# Altium schematic sheet MicroSD.SchDoc: Cartão SD
size A4; ENG_APP_DATE: --/--/--; DSN_APP_DATE: --/--/--; CHK_APP_DATE: --/--/--; Date: *******; ApprovedBy: *******; CheckedBy: None; Author: *******; CompanyName: *******; DrawnBy: Name; Engineer: *******; Organization: *******; Address1: *******; Address2: *******; Address3: *******; Address4: *******; DocumentNumber: Doc Num; Revision: *******; SheetNumber: 6; SheetTotal: 7; CurrentTime: *******; CurrentDate: *******; Time: *******; DocumentFullPathAndName: *******; DocumentName: *******; ModifiedDate: *******; ImagePath: *******; ProjectName: *******; Application_BuildNumber: *******
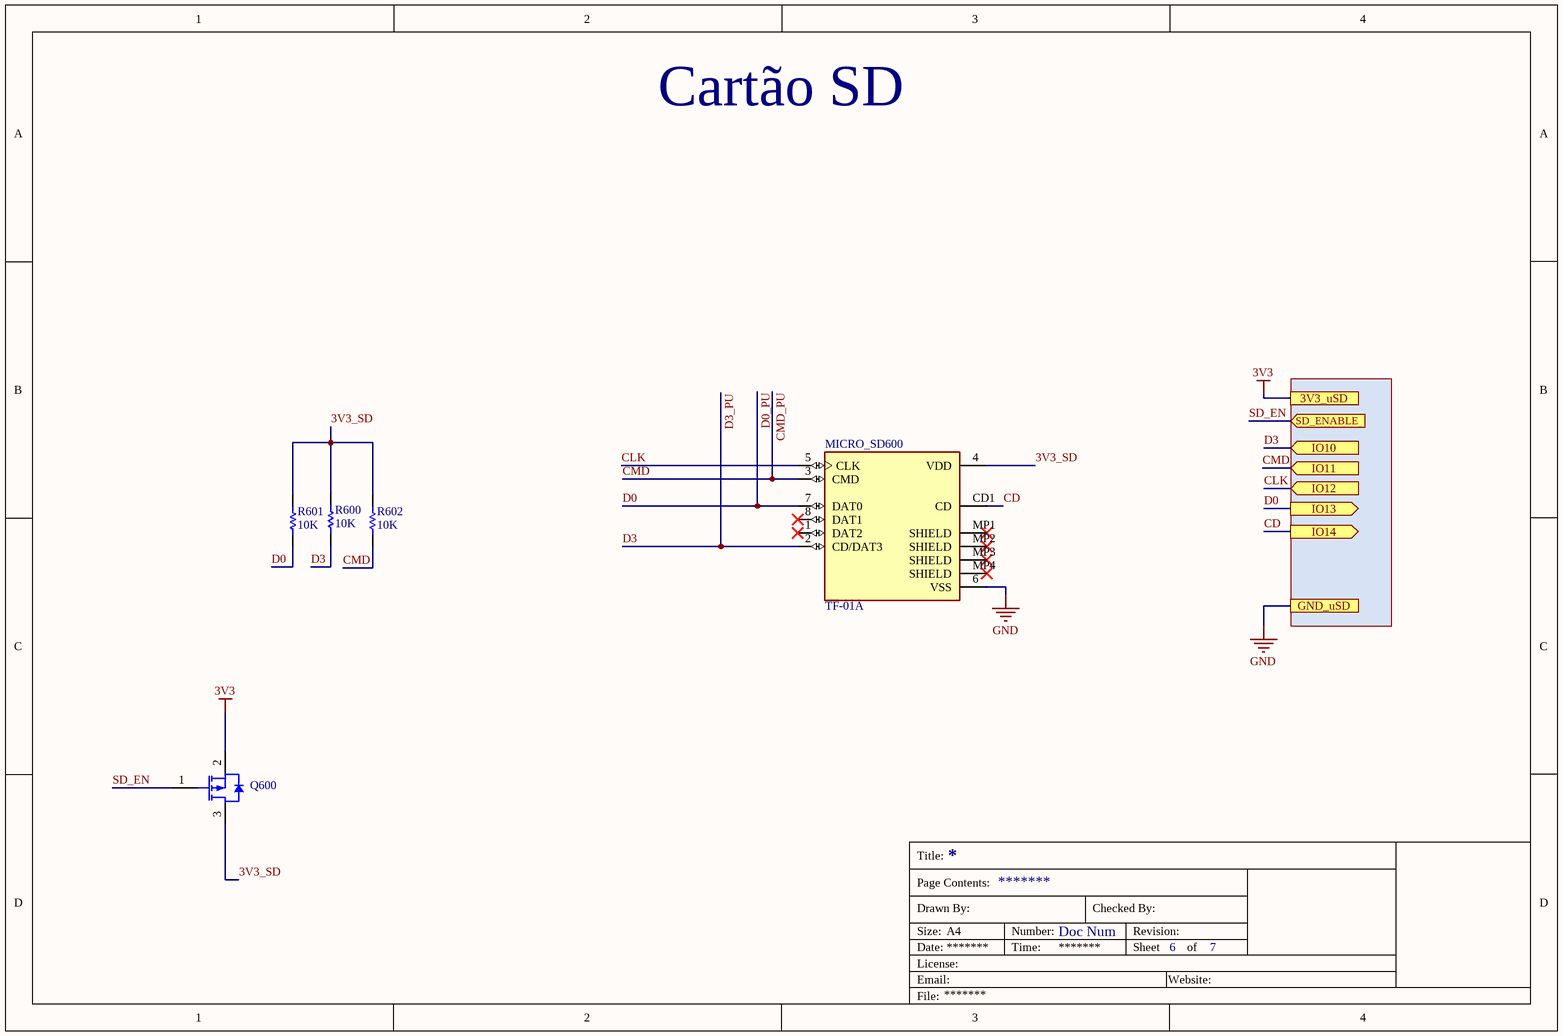
[diagram p0: MicroSD.SchDoc]

## Parts
MICRO_SD600  TF-01A  [TF-01A]
Q600  IC MOSFET P_CHANNEL 20V 6A  [SOT-23]  (value not drawn)
R600  10K  [CR2012-0805]
R601  10K  [CR2012-0805]
R602  10K  [CR2012-0805]

## Ports
3V3_uSD, GND_uSD, IO10 (in), IO11 (in), IO12 (in), IO13 (out), IO14 (out), SD_ENABLE (in)

## Nets
3V3: Q600.2(SOURCE) ; port 3V3_uSD
GND: MICRO_SD600.6(VSS) ; port GND_uSD
3V3_SD: MICRO_SD600.4(VDD) Q600.3(DRAIN) R600.2 R601.2 R602.2
CD: MICRO_SD600.CD1(CD) ; port IO14
CLK: MICRO_SD600.5(CLK) ; port IO12
CMD: MICRO_SD600.3(CMD) R602.1 ; port IO11  [also labelled CMD_PU]
D0: MICRO_SD600.7(DAT0) R601.1 ; port IO13  [also labelled D0_PU]
D3: MICRO_SD600.2(CD/DAT3) R600.1 ; port IO10  [also labelled D3_PU]
SD_EN: Q600.1(GATE) ; port SD_ENABLE

Not connected (* = marked no-connect by the designer): MICRO_SD600 1(DAT2)* 8(DAT1)* MP1(SHIELD)* MP2(SHIELD)* MP3(SHIELD)* MP4(SHIELD)*

## Notes on the sheet
- Title:
- Drawn By:
- Page Contents:
- Checked By:
- Size:
- Date:
- File:
- License:
- Email:
- A4
- Number:
- Time:
- Revision:
- Sheet
- Website:
- of

## Library data of the parts
MICRO_SD600 = CMP-030-000000-2: Standard Card Edge Connectors; MF: HRO Electronics Co., Ltd.; Component Type: Standard; Package: Package; Design Item ID: TF-01A; Availability: Not in stock; Price: None; Source: TF-01A.SchLib; MP: TF-01A; Value: *; Check_prices: https://www.snapeda.com/parts/TF-01A/HRO+Electronics+Co.%252C+Ltd./view-part/?ref=eda; SnapEDA_Link: https://www.snapeda.com/parts/TF-01A/HRO+Electronics+Co.%252C+Ltd./view-part/?ref=snap; Pin Count: 13
Q600 = IC MOSFET P_CHANNEL 20V 6A: Small Low ON Resistance MOSFET P-Channel 20V 6A 3-Pin SOT-23F T/R; Manufacturer: Toshiba; Manufacturer Part Number: SSM3J358R,LF; ComponentLink1URL: https://datasheet.ciiva.com/30023/dmp31d0u-30023794.pdf?src-supplier=Avnet; ComponentLink1Description: https://datasheet.ciiva.com/30023/dmp31d0u-30023794.pdf?src-supplier=Avnet; Supplier 1: Avnet; RoHS: No; Category: MOSFETs; Stock 1: 12000; Pricing 1: 3000=0,10175, 6000=0,09625, 12000=0,09075, 18000=0,08525, 24000=0,07975, 30000=0,07425, 300000=0,06875 (USD); Supplier 2: LCSC; Supplier Part Number 1: SSM3J358R,LF; Supplier Part Number 2: C148356
R600-R602 = CMP-018-000030-1: RES 0805 10K Ohm 0.1% 1/10W  SMD; Manufacturer Part Number: ERJ-6ENF1002V; Manufacturer: Panasonic Electronic Components; Number of Resistors: 1; Voltage Rating (DC): 150V; Max Power Dissipation: 125mW; Temperature Coefficient: ±100ppm/°C; Tolerance: ±1%; Resistance: 10kR; Power (Watts): 0.125W, 1/8W; ComponentLink6URL: https://datasheet.ciiva.com/16725/70260748-16725031.pdf?src-supplier=Allied+Electronics; Package / Case: 0805 (2012 Metric); Supplier Device Package: 0805; Resistance (Ohms): 10k; ComponentLink14Description: https://datasheet.ciiva.com/24440/eng-ds-1773270-l-24440188.pdf?src-supplier=Onlinecomponents.com; Operating Temperature: -55°C ~ 155°C; ComponentLink15Description: https://datasheet.ciiva.com/7731/eng-ds-1773270-l-7731311.pdf?src-supplier=Element14; ComponentLink7Description: https://datasheet.ciiva.com/46372/1678782-46372714.pdf?src-supplier=Element14; ComponentLink13Description: https://datasheet.ciiva.com/16723/70063741-16723029.pdf?src-supplier=Allied+Electronics; Contact Plating: Tin; Part Status: Active; ComponentLink11Description: https://datasheet.ciiva.com/30140/aoa0000ce2-30140236.pdf?src-supplier=Onlinecomponents.com; ComponentLink6Description: https://datasheet.ciiva.com/16725/70260748-16725031.pdf?src-supplier=Allied+Electronics; Lead Free: Lead Free; ComponentLink14URL: https://datasheet.ciiva.com/24440/eng-ds-1773270-l-24440188.pdf?src-supplier=Onlinecomponents.com; Design Item ID: RES 10K OHM 1% 1/8W 0805 SMD; ComponentLink7URL: https://datasheet.ciiva.com/46372/1678782-46372714.pdf?src-supplier=Element14; ComponentLink3Description: https://datasheet.ciiva.com/16514/aoa0000ce2-16514021.pdf?src-supplier=Avnet+Asia; Category: Resistors; ComponentLink13URL: https://datasheet.ciiva.com/16723/70063741-16723029.pdf?src-supplier=Allied+Electronics; Case Code (Imperial): 0805; Failure Rate: -; Stock 1: 2392770; ComponentLink5URL: https://datasheet.ciiva.com/16759/70260748-16759350.pdf?src-supplier=Allied+Electronics; Features: Automotive AEC-Q200; ComponentLink12URL: https://datasheet.ciiva.com/24070/aoa0000ce2-24070702.pdf?src-supplier=Mouser; ComponentLink9URL: https://datasheet.ciiva.com/7830/426256-7830745.pdf?src-supplier=Element14; Termination: SMD/SMT; ComponentLink10Description: https://datasheet.ciiva.com/17212/aoa0000ce2-17212108.pdf?src-supplier=Avnet+Europe; Length: 2mm; ComponentLink15URL: https://datasheet.ciiva.com/7731/eng-ds-1773270-l-7731311.pdf?src-supplier=Element14; ComponentLink8Description: https://datasheet.ciiva.com/46372/1678782-46372715.pdf?src-supplier=Element14; ComponentLink11URL: https://datasheet.ciiva.com/30140/aoa0000ce2-30140236.pdf?src-supplier=Onlinecomponents.com; Size / Dimension: 0.079" L x 0.049" W (2.00mm x 1.25mm); ComponentLink9Description: https://datasheet.ciiva.com/7830/426256-7830745.pdf?src-supplier=Element14; REACH SVHC: No SVHC; Source: mits.SchLib; Military Standard: Not; ComponentLink5Description: https://datasheet.ciiva.com/16759/70260748-16759350.pdf?src-supplier=Allied+Electronics; ComponentLink1Description: https://industrial.panasonic.com/cdbs/www-data/pdf/RDA0000/AOA0000C283.pdf; ComponentLink16URL: https://datasheet.ciiva.com/14181/jcrn73-data-e-14181423.pdf?src-supplier=Distrelec; Stock 2: 1650; Working Voltage: 150V; ComponentLink8URL: https://datasheet.ciiva.com/46372/1678782-46372715.pdf?src-supplier=Element14; ComponentLink10URL: https://datasheet.ciiva.com/17212/aoa0000ce2-17212108.pdf?src-supplier=Avnet+Europe; Number of Pins: 2; Height: 0.6mm; ComponentLink4Description: https://datasheet.ciiva.com/27055/1988971-27055733.pdf?src-supplier=Jameco; ComponentLink4URL: https://datasheet.ciiva.com/27055/1988971-27055733.pdf?src-supplier=Jameco; Pricing 2: 1=1,68000, 10=1,48900, 100=1,13720, 1000=0,73645 (USD); Radiation Hardening: No; ComponentLink16Description: https://datasheet.ciiva.com/14181/jcrn73-data-e-14181423.pdf?src-supplier=Distrelec; Pricing 1: 1=0.1, 10=0.036, 25=0.0264, 50=0.02, 100=0.0148, 250=0.01124, 500=0.009, 1000=0.00663 (USD); ELV: Compliant; Width: 0.049inch; RoHS: RoHS Compliant; Number of Terminations: 2; ComponentLink2Description: https://datasheet.ciiva.com/11808/0900766b80f80784-11808080.pdf?src-supplier=RSComponents; Power Rating: 125mW; ComponentLink1URL: https://industrial.panasonic.com/cdbs/www-data/pdf/RDA0000/AOA0000C283.pdf; Mount: Surface Mount; Depth: 1.25mm; Case Code (Metric): 2012; ComponentLink12Description: https://datasheet.ciiva.com/24070/aoa0000ce2-24070702.pdf?src-supplier=Mouser; ComponentLink3URL: https://datasheet.ciiva.com/16514/aoa0000ce2-16514021.pdf?src-supplier=Avnet+Asia; ComponentLink2URL: https://datasheet.ciiva.com/11808/0900766b80f80784-11808080.pdf?src-supplier=RSComponents; Height - Seated (Max): 0.028" (0.70mm); Case/Package: 0805; Max Operating Temperature: 155°C; Packaging: Cut Tape (CT); Package Quantity: 5000; Voltage Rating: 150V; Min Operating Temperature: -55°C; Composition: Thick Film